# EAGLE schematic simple (EAGLE 9.0.0)
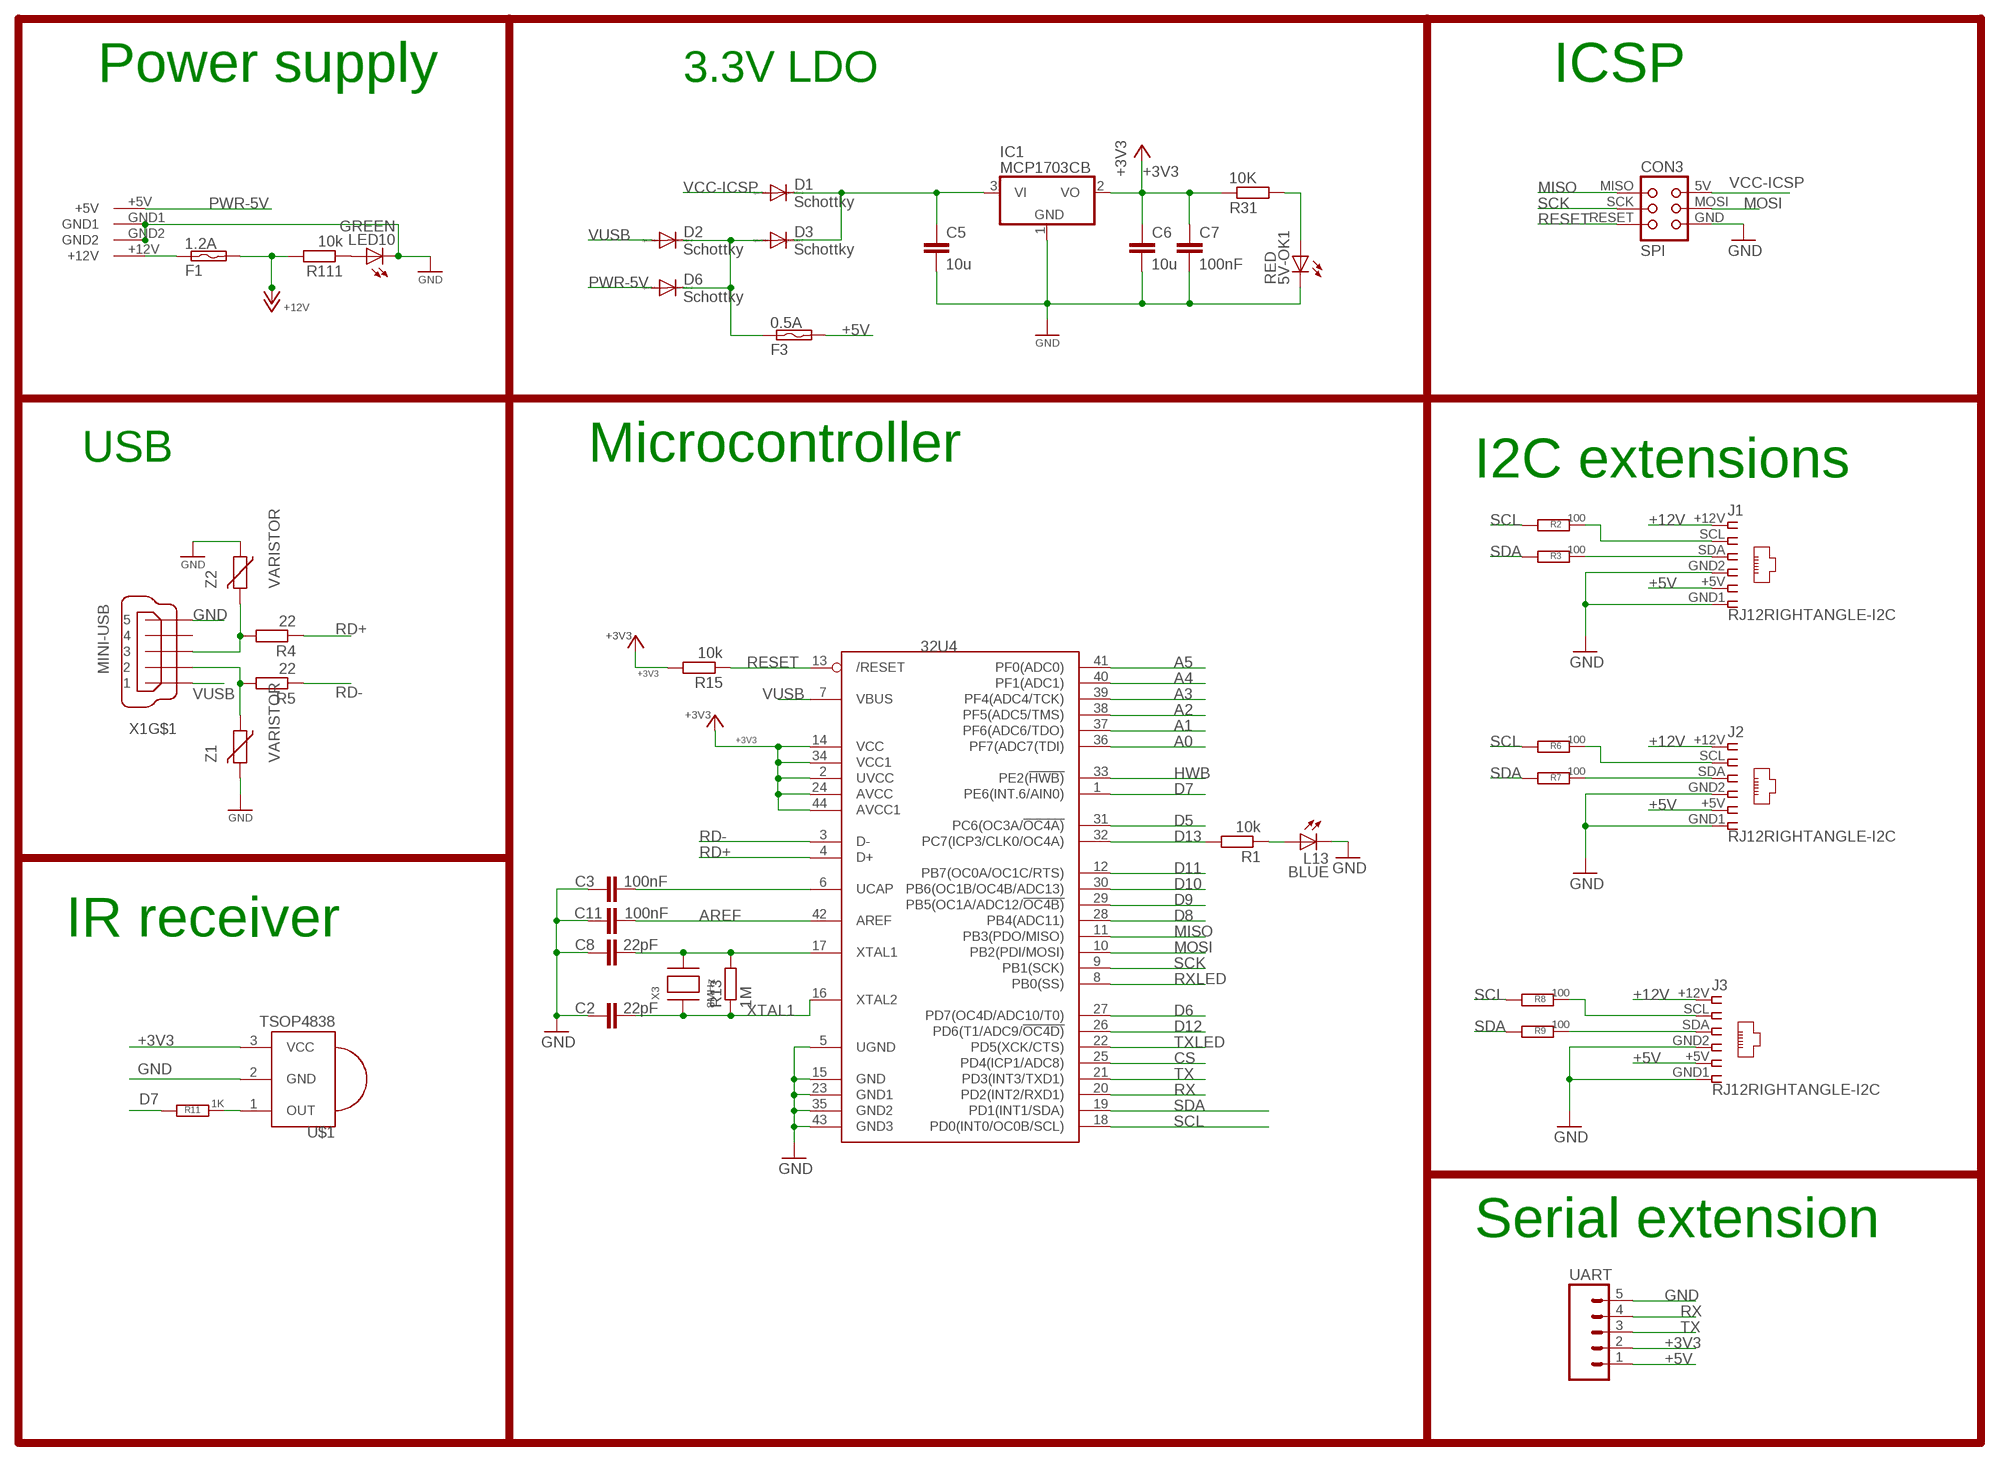
[diagram p0: schematic, sheet 1]

## Parts
5V-OK1  RED  LEDCHIP-LED0805  [CHIP-LED0805]
C2  22pF  C-EUC0805K  [C0805K]
C3  100nF  C-EUC0805K  [C0805K]
C5  10u  C-EUC0805K  [C0805K]
C6  10u  C-EUC0805K  [C0805K]
C7  100nF  C-EUC0805K  [C0805K]
C8  22pF  C-EUC0805K  [C0805K]
C11  100nF  C-EUC0805K  [C0805K]
CON3  SPI  TINYISPT  [TC2030-MCP-NL]
D1  Schottky  MBR0520LT  [SOD123]
D2  Schottky  MBR0520LT  [SOD123]
D3  Schottky  MBR0520LT  [SOD123]
D6  Schottky  MBR0520LT  [SOD123]
F1  1.2A  POLYSWITCHSMD1812  [C1812]
F3  0.5A  POLYSWITCHSMD1812  [C1812]
IC1  MCP1703CB  [SOT23]
J1  RJ12RIGHTANGLE-I2C  [RJ12-RIGHTANGLE-I2C]
J2  RJ12RIGHTANGLE-I2C  [RJ12-RIGHTANGLE-I2C]
J3  RJ12RIGHTANGLE-I2C  [RJ12-RIGHTANGLE-I2C]
L13  BLUE  LEDCHIP-LED0805  [CHIP-LED0805]
LED10  GREEN  LEDCHIP-LED0805  [CHIP-LED0805]
R1  10k  R-EU_M0805  [M0805]
R2  100  R-EU_R0805  [R0805]
R3  100  R-EU_R0805  [R0805]
R4  22  R-EU_R0805  [R0805]
R5  22  R-EU_R0805  [R0805]
R6  100  R-EU_R0805  [R0805]
R7  100  R-EU_R0805  [R0805]
R8  100  R-EU_R0805  [R0805]
R9  100  R-EU_R0805  [R0805]
R11  1K  R-EU_R0805  [R0805]
R13  1M  R-EU_M0805  [M0805]
R15  10k  R-EU_M0805  [M0805]
R31  10K  R-EU_R0805  [R0805]
R111  10k  R-EU_R0805  [R0805]
U$1  TSOP4838  PNA460XM  [PNA460XM]
U$4  32U4  ATMEGA32U4-AU  [TQFP44]
U$6  KPJX-4S-S  [KPJX-4S-S]
UART  M05PTH  [1X05]
X1  MINI-USB  MINI-USB-SCHIELD-32005-201  [32005-201]
X3  8MHz  XTALNX6035  [NX6035]
Z1  VARISTOR  VARISTORCN0603  [CT/CN0603]
Z2  VARISTOR  VARISTORCN0603  [CT/CN0603]

## Nets
+3V3 [fine]: C6.1 C7.1 IC1.2(VO) R15.2 R31.1 U$1.3(VCC) U$4.2(UVCC) U$4.14(VCC) U$4.24(AVCC) U$4.34(VCC1) U$4.44(AVCC1) UART.2
+5V [fine]: F3.2 J1.+5V J2.+5V J3.+5V UART.1
+12V [power]: F1.2 J1.+12V J2.+12V J3.+12V R111.2
+XV: C5.1 D1.C D3.C IC1.3(VI)
A0: U$4.36(PF7(ADC7(TDI))
A1: U$4.37(PF6(ADC6/TDO))
A2: U$4.38(PF5(ADC5/TMS))
A3: U$4.39(PF4(ADC4/TCK))
A4: U$4.40(PF1(ADC1))
A5: U$4.41(PF0(ADC0))
AREF: C11.1 U$4.42(AREF)
CS: U$4.25(PD4(ICP1/ADC8))
D5: U$4.31(PC6(OC3A/!OC4A))
D6: U$4.27(PD7(OC4D/ADC10/T0))
D7: R11.2 U$4.1(PE6(INT.6/AIN0))
D8: U$4.28(PB4(ADC11))
D9: U$4.29(PB5(OC1A/ADC12/!OC4B))
D10: U$4.30(PB6(OC1B/OC4B/ADC13))
D11: U$4.12(PB7(OC0A/OC1C/RTS))
D12: U$4.26(PD6(T1/ADC9/!OC4D))
D13: R1.2 U$4.32(PC7(ICP3/CLK0/OC4A))
GND [power]: 5V-OK1.C C2.1 C3.1 C5.2 C6.2 C7.2 C8.1 C11.2 CON3.GND IC1.1(GND) J1.GND1 J1.GND2 J2.GND1 J2.GND2 J3.GND1 J3.GND2 L13.C LED10.C U$1.2(GND) U$4.5(UGND) U$4.15(GND) U$4.23(GND1) U$4.35(GND2) U$4.43(GND3) U$6.GND1 U$6.GND2 UART.5 X1.5 Z1.2 Z2.1
HWB: U$4.33(PE2(!HWB))
MISO: CON3.MISO U$4.11(PB3(PDO/MISO))
MOSI: CON3.MOSI U$4.10(PB2(PDI/MOSI))
N$1: J2.SCL R6.1
N$2: J1.SCL R2.1
N$3: J1.SDA R3.1
N$4: L13.A R1.1
N$5: D2.C D3.A D6.C F3.1
N$6: J2.SDA R7.1
N$7: J3.SCL R8.1
N$8: J3.SDA R9.1
N$9: R11.1 U$1.1(OUT)
N$10: 5V-OK1.A R31.2
N$16: C3.2 U$4.6(UCAP)
N$39: F1.1 U$6.+12V
N$42: C8.2 R13.2 U$4.17(XTAL1) X3.P$2
N$75: LED10.A R111.1
PWR-5V: D6.A U$6.+5V
RD+ [USBB]: R4.1 U$4.4(D+)
RD- [USBB]: R5.1 U$4.3(D-)
RESET: CON3.RESET R15.1 U$4.13(/RESET)
RX: U$4.20(PD2(INT2/RXD1)) UART.4
RXLED: U$4.8(PB0(SS))
SCK: CON3.SCK U$4.9(PB1(SCK))
SCL: R2.2 R6.2 R8.2 U$4.18(PD0(INT0/OC0B/SCL))
SDA: R3.2 R7.2 R9.2 U$4.19(PD1(INT1/SDA))
TX: U$4.21(PD3(INT3/TXD1)) UART.3
TXLED: U$4.22(PD5(XCK/CTS))
USBC_N: R5.2 X1.2 Z1.1
USBC_P: R4.2 X1.3 Z2.2
VCC-ICSP: CON3.5V(VCC) D1.A
VUSB: D2.A U$4.7(VBUS) X1.1
XTAL1: C2.2 R13.1 U$4.16(XTAL2) X3.P$1
Unconnected: X1.4 X1.M1(S:S1) X1.M2(S:S2) X1.M3(S:S3) X1.M4(S:S4)

## Notes on the sheet
- Power supply | 3.3V LDO | ICSP
- USB | Microcontroller
- I2C extensions
- IR receiver
- Serial extension

## Library data of the parts
5V-OK1 L13 LED10 = adafruit:LED: LED OSRAM: - CHIPLED LG R971, LG N971, LY N971, LG Q971, LY Q971, LO R971, LY R971 LH N974, LH R974 LS Q976, LO Q976, LY Q976 LO Q996 - Hyper CHIPLED LW Q18S LB Q993, LB Q99A, LB R99A - SideLED LS A670, LO A670, LY A670, LG A670, LP A670 LB A673, LV A673, LT A673, LW A673 LH A674 LY A675 LS A676, LA A676, LO A676, LY A676, LW A676 LS A679, LY A679, LG A679 - Hyper Micro SIDELED® LS Y876, LA Y876, LO Y876, LY Y876 LT Y87S - SmartLED LW L88C, LW L88S LB L89C, LB L89S, LG L890 LS L89K, LO L89K, LY L89K LS L896, LA L896, LO L896, LY L896 - TOPLED LS T670, LO T670, LY T670, LG T670, LP T670 LSG T670, LSP T670, LSY T670, LOP T670, LYG T670 LG T671, LOG T671, LSG T671 LB T673, LV T673, LT T673, LW T673 LH T674 LS T676, LA T676, LO T676, LY T676, LB T676, LH T676, LSB T676, LW T676 LB T67C, LV T67C, LT T67C, LS T67K, LO T67K, LY T67K, LW E67C LS E67B, LA E67B, LO E67B, LY E67B, LB E67C, LV E67C, LT E67C LW T67C LS T679, LY T679, LG T679 LS T770, LO T770, LY T770, LG T770, LP T770 LB T773, LV T773, LT T773, LW T773 LH T774 LS E675, LA E675, LY E675, LS T675 LS T776, LA T776, LO T776, LY T776, LB T776 LHGB T686 LT T68C, LB T68C - Hyper Mini TOPLED® LB M676 - Mini TOPLED Santana® LG M470 LS M47K, LO M47K, LY M47K Source: http://www.osram.convergy.de/
C2 C3 C8 C11 = rcl:C-EU: CAPACITOR, European symbol
C5 C6 = rcl:C-EU: CAPACITOR, European symbol; ELECROW: C15850; LCSC: C15850; MPN: 77-VJ1206V106ZXQTBC; SPICEPREFIX: C
C7 = rcl:C-EU: CAPACITOR, European symbol; ELECROW: C49678; LCSC: C49678; MPN: 80-C1206C104K5R; SPICEPREFIX: C
CON3 = lpatiny:TINYISP: CONNECTOR
D1-D3 D6 = diode:MBR0520LT: SCHOTTKY BARRIER RECTIFIER Source: http://onsemi.com .. MBR0520LT1-D.pdf; LCSC: C82544; MPN: 621-1N5819HW-F
F1 F3 = lpatiny:POLYSWITCH: PolySwitch (TM) Resettable Device Source: Data sheet <http://www.farnell.com/datasheets/13482.pdf>
IC1 = linear:MCP1703: 250 mA, 16V, Low Quiescent Current LDO Regulator Source: http://ww1.microchip.com/downloads/en/DeviceDoc/22049b.pdf; LCSC: C53352
J1-J3 = lpatiny:RJ12: CORCOM Modular RJ Jacks No Shield Source: www.tycoelectronics.com .. ENG_DS_1654001_1099_RJ_L_0507.pdf
R1-R3 R6-R9 R11 R15 R31 = resistor:R-EU_: RESISTOR, European symbol
R4 = rcl:R-EU_: RESISTOR, European symbol; ELECROW: C17561; LCSC: C17561
R5 = rcl:R-EU_: RESISTOR, European symbol; ELECROW: C17561; LCSC: C17561; SPICEPREFIX: R
R13 R111 = rcl:R-EU_: RESISTOR, European symbol
U$1 = adafruit:PNA460XM: IR 38KHz receiver PNA4602 and related receivers http://www.ladyada.net/library/pcb/eaglelibrary.html
U$4 = adafruit:ATMEGA32U4: http://www.ladyada.net/library/eagle
U$6 = lpatiny:KPJX-4S-S
UART = SparkFun-Connectors:M05: Header 5 Standard 5-pin 0.1" header. Use with straight break away headers (SKU : PRT-00116), right angle break away headers (PRT-00553), swiss pins (PRT-00743), machine pins (PRT-00117), and female headers (PRT-00115). Molex polarized connector foot print use with SKU : PRT-08230 with associated crimp pins and housings.
X1 = con-cypressindustries:MINI-USB-SCHIELD-: MINI USB-B Conector Source: www.cypressindustries.com; LCSC: C46391; MPN: 649-10033526-N3212LF
X3 = lpatiny:XTAL: Low cost SMT crystals, no capacitors included http://www.ladyada.net/library/eagle
Z1 Z2 = varistor:VARISTOR: VARISTOR

## Net classes
0 default: width 0.406 mm, clearance 0.25 mm
1 power: width 0.254 mm
2 VIN: width 0.254 mm
3 fine: width 0.254 mm
4 aref: width 0.254 mm
5 USBA: width 0.254 mm, clearance 0.254 mm
6 USBB: width 0.254 mm, clearance 0.254 mm